# Altium schematic sheet UserInterface.SchDoc: Treetap 7C - User Interface
size A3; Author: Treetap Group; DrawnBy: Treetap Group; Revision: 1; SheetNumber: 7; SheetTotal: 7; PageSetup: Record=PageOptions|CenterHorizontal=True|CenterVertical=True|PrintScale=1.03|XCorrection=1.00|YCorrection=1.00|PrintKind=1|BorderSize=5000000|LeftOffset=0|BottomOffset=0|Orientation=2|PaperLength=1000|PaperWidth=1000|Scale=100|PaperSource=15|PrintQuality=600|MediaType=1|DitherType=10|PaperKind=A3|PrintScaleMode=1
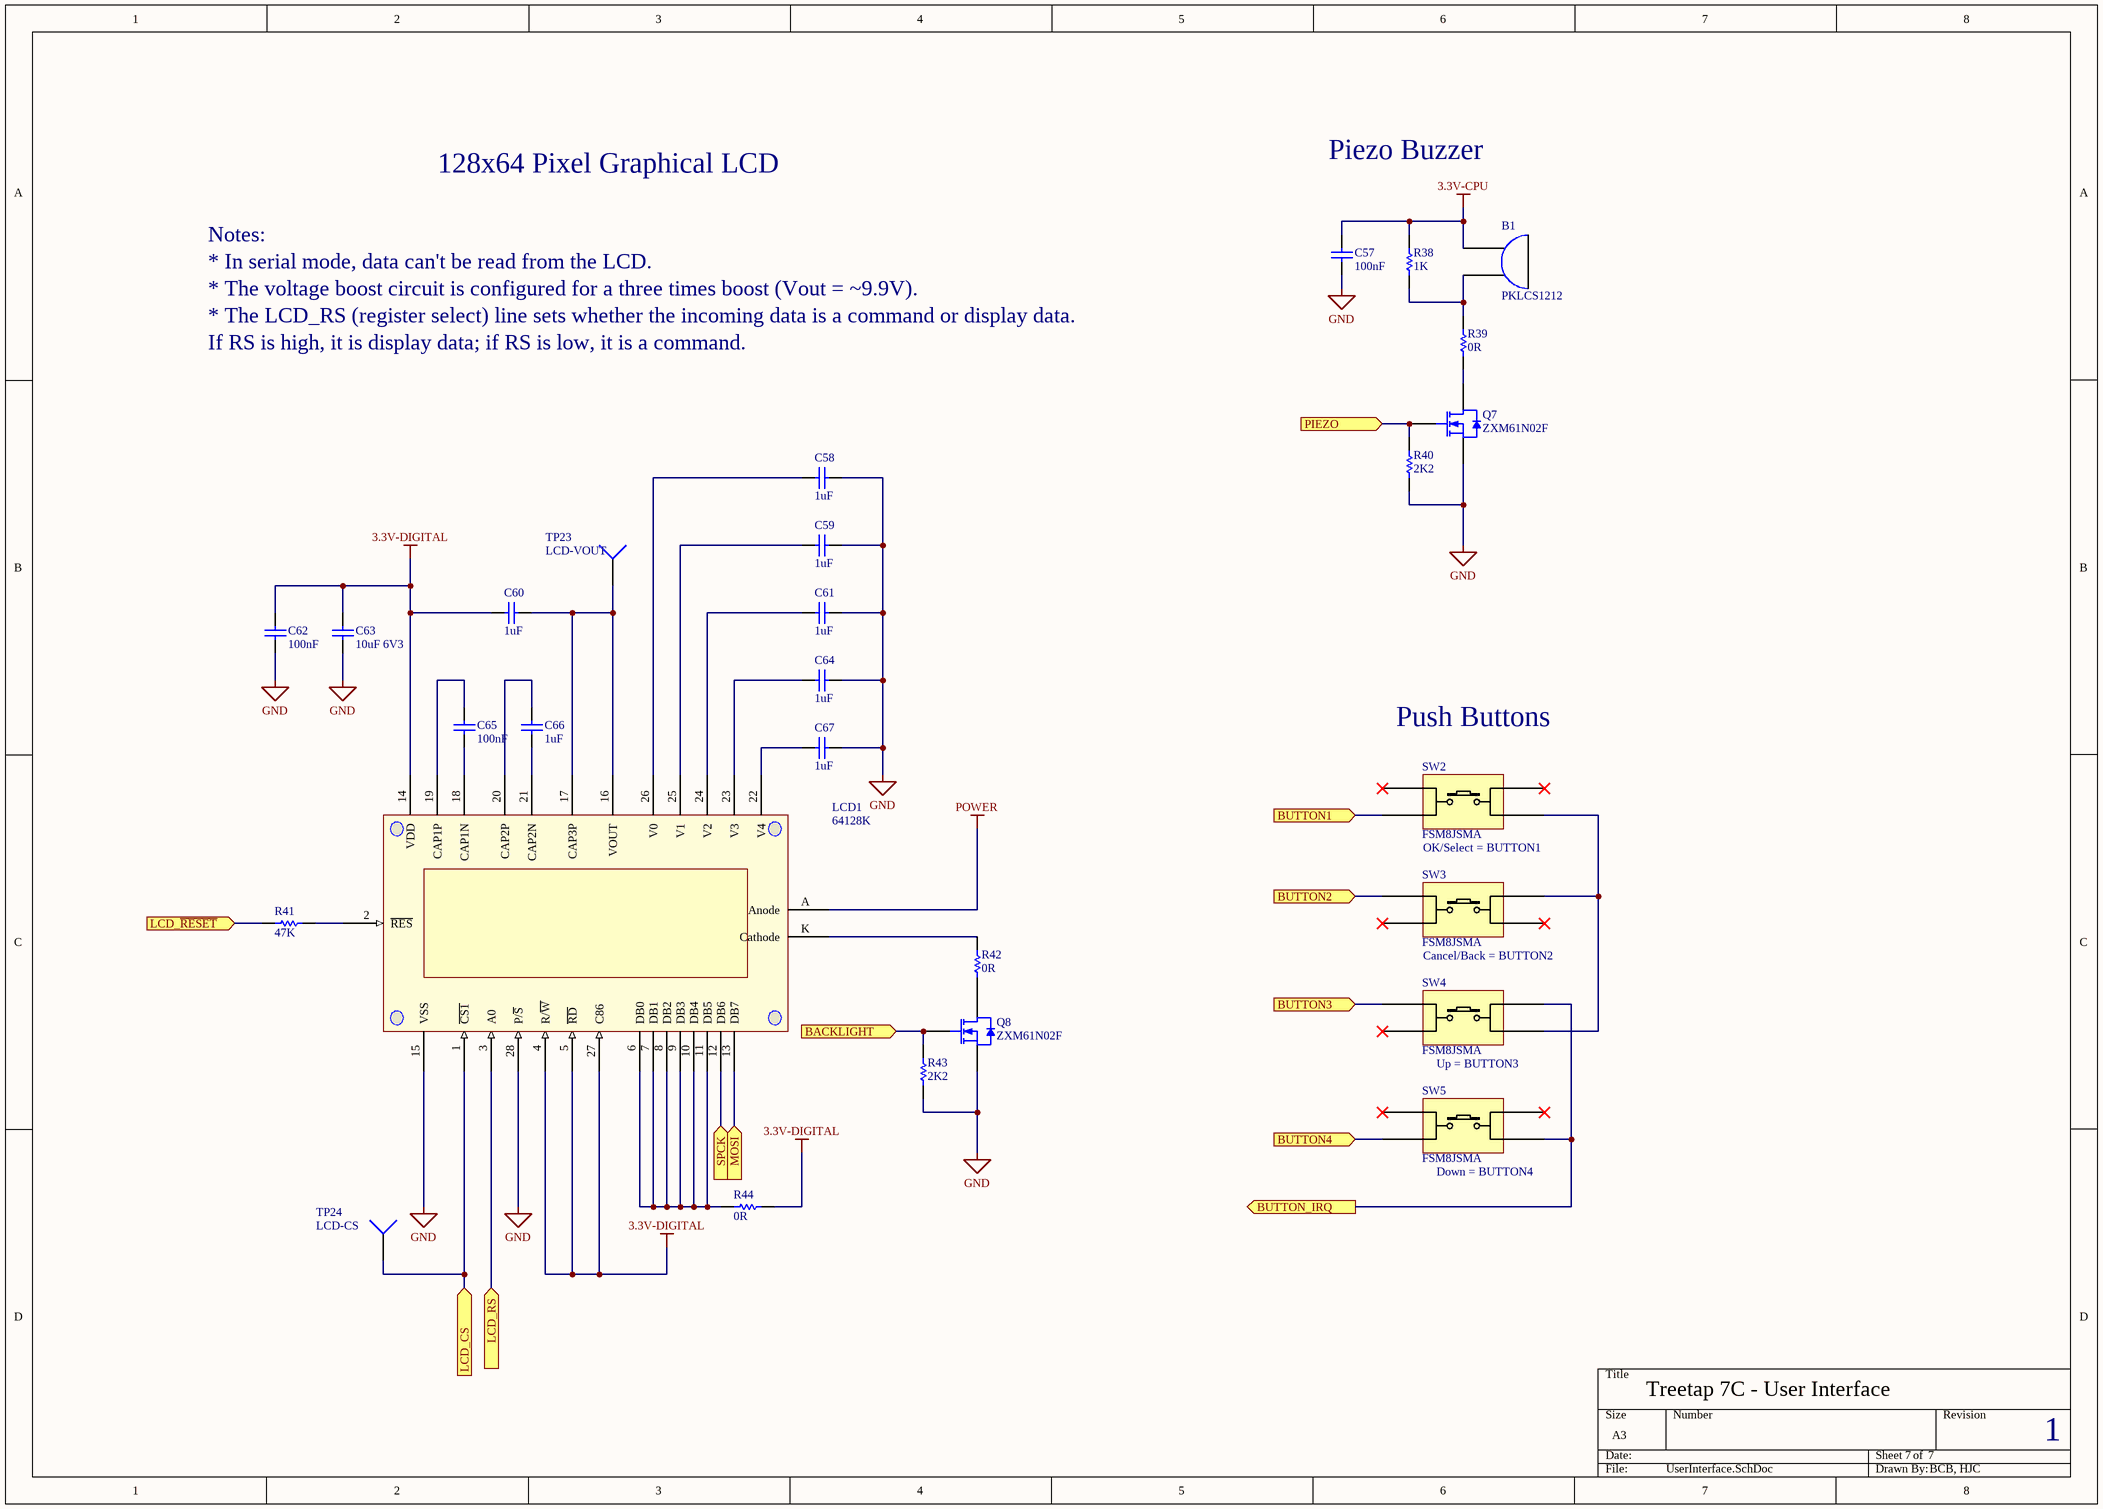
[diagram p0: UserInterface.SchDoc]

## Parts
B1  PKLCS1212  [PKSCL1212]
C57  100nF  [CC0603]
C58  1uF  [CC0603]
C59  1uF  [CC0603]
C60  1uF  [CC0603]
C61  1uF  [CC0603]
C62  100nF  [CC0603]
C63  10uF 6V3  [CC0603]
C64  1uF  [CC0603]
C65  100nF  [CC0603]
C66  1uF  [CC0603]
C67  1uF  [CC0603]
LCD1  64128K  [64128K]
Q7  ZXM61N02F  [SOT-23]
Q8  ZXM61N02F  [SOT-23]
R38  1K  [R0603]
R39  0R  [R0603]
R40  2K2  [R0603]
R41  47K  [R0603]
R42  0R  [R0603]
R43  2K2  [R0603]
R44  0R  [R0603]
SW2  FSM8JSMA  [FSM8JSMA]
SW3  FSM8JSMA  [FSM8JSMA]
SW4  FSM8JSMA  [FSM8JSMA]
SW5  FSM8JSMA  [FSM8JSMA]
TP23  LCD-VOUT  [SMTP_1]
TP24  LCD-CS  [SMTP_1]

## Ports
BACKLIGHT (in), BUTTON1 (in), BUTTON2 (in), BUTTON3 (in), BUTTON4 (in), BUTTON_IRQ (out), LCD_CS (in), LCD_RS (in), LCD_~{RESET} (in), MOSI (in), PIEZO (in), SPCK (in)

## Nets
3.3V-CPU: B1.0 C57.2 R38.2
3.3V-DIGITAL: C60.2 C62.2 C63.2 LCD1.4(R/~{W}) LCD1.5(~{RD}) LCD1.14(VDD) LCD1.27(C86) R44.2
GND: C57.1 C58.1 C59.1 C61.1 C62.1 C63.1 C64.1 C67.1 LCD1.15(VSS) LCD1.28(P/~{S}) Q7.2(S) Q8.2(S) R40.1 R43.1
POWER: LCD1.A(Anode)
BACKLIGHT: Q8.1(G) R43.2 ; port BACKLIGHT
BUTTON1: SW2.2 ; port BUTTON1
BUTTON2: SW3.1 ; port BUTTON2
BUTTON3: SW4.1 ; port BUTTON3
BUTTON4: SW5.2 ; port BUTTON4
BUTTON_IRQ: SW4.4 SW5.3 ; port BUTTON_IRQ
LCD_CS: LCD1.1(~{CS1}) TP24.1 ; port LCD_CS
LCD_~{RESET}: R41.1 ; port LCD_~{RESET}
LCD_RS: LCD1.3(A0) ; port LCD_RS
MOSI: LCD1.13(DB7) ; port MOSI
PIEZO: Q7.1(G) R40.2 ; port PIEZO
SPCK: LCD1.12(DB6) ; port SPCK
NetB1_1: B1.1 R38.1 R39.2
NetC58_2: C58.2 LCD1.26(V0)
NetC59_2: C59.2 LCD1.25(V1)
NetC60_1: C60.1 LCD1.16(VOUT) LCD1.17(CAP3P) TP23.1
NetC61_2: C61.2 LCD1.24(V2)
NetC64_2: C64.2 LCD1.23(V3)
NetC65_1: C65.1 LCD1.18(CAP1N)
NetC65_2: C65.2 LCD1.19(CAP1P)
NetC66_1: C66.1 LCD1.21(CAP2N)
NetC66_2: C66.2 LCD1.20(CAP2P)
NetC67_2: C67.2 LCD1.22(V4)
NetLCD1_2: LCD1.2(~{RES}) R41.2
NetLCD1_6: LCD1.6(DB0) LCD1.7(DB1) LCD1.8(DB2) LCD1.9(DB3) LCD1.10(DB4) LCD1.11(DB5) R44.1
NetLCD1_K: LCD1.K(Cathode) R42.2
NetQ7_3: Q7.3(D) R39.1
NetQ8_3: Q8.3(D) R42.1
NetSW2_3: SW2.3 SW3.4 SW4.3

Not connected (* = marked no-connect by the designer): SW2 1* 4*; SW3 2* 3*; SW4 2*; SW5 1* 4*

## Notes on the sheet
- 128x64 Pixel Graphical LCD
- Piezo Buzzer
- Notes:
- * In serial mode, data can't be read from the LCD.
- * The voltage boost circuit is configured for a three times boost (Vout = ~9.9V).
- * The LCD_RS (register select) line sets whether the incoming data is a command or display data.
- If RS is high, it is display data; if RS is low, it is a command.
- Push Buttons
- OK/Select = BUTTON1
- Cancel/Back = BUTTON2
- Up = BUTTON3
- (near SW5) Down = BUTTON4
- Treetap 7C - User Interface
- 7
- 1
- BCB, HJC

## Library data of the parts
B1 = PKLCS1212: 4kHz surface mount piezo; Manufacturer: Murata; Part Number: PKLCS1212E4001-R1; Order multiple: 1; price: 10.40; Supplier_Name: RS Components; Supplier_Component_Code: 619-8456; published: 15/02/2010; value: PKLCS1212; Pack of: 1
C57 C62 C65 = 100nF_CC0603: 0603 Capacitor; Supplier_Component_Code: RC-P100; published: 28/03/2007 10:54:57 a.m.; Supplier_Name: Soanar Plus; price: 0.09; value: 100nF; Part Number: 100nF_CC0603; Component Kind: Standard; Component Type: Standard; Designator: 100nF_CC0603; Pin Count: 2
C58-C61 C64 C66 C67 = 1uF_0603_25V_ceramic: 1uF 25V 0603 ceramic capacitor; Manufacturer: Kemet; Part Number: C0603C105K3PAC; Order multiple: 10; Pack of: 1; Supplier_Component_Code: 1288202; published: 15/02/2010; Supplier_Name: Farnell; price: 0.465; value: 1uF
C63 = 10uF_CC0603_6V3: 10uF 6.3V 0603 ceramic capacitor; Manufacturer: Multicomp; Part Number: MCCA000517; Supplier_Component_Code: 1759393; published: 8/06/2010; Supplier_Name: Farnell; price: 0.218; value: 10uF 6V3
LCD1 = 64128K: 64x128 COG LCD module; Part Number: 64128K-FC-BW-3; Manufacturer: Displaytech; Order multiple: 1; Supplier_Name: RS Components; Supplier_Component_Code: 564-399; price: 28.20; Published: 23/02/2010; Pack of: 1; value: 64128K
Q7 Q8 = ZXM61N02F: 20V N-channel enhancement mode MOSFET; Manufacturer: Zetex; Order multiple: 5; Pack of: 1; Supplier_Name: Farnell; Supplier_Component_Code: 9525270; price: 1.28; published: 7/12/2007; value: ZXM61N02F; Part Number: ZXM61N02F
R38 = 1K_R0603: 0603 Resistor; ECE_Component_Code: 1K_R0603; value: 1K; Supplier_Component_Code: RS-S073; published: 12/03/2007 11:34:34 a.m.; Supplier_Name: Soanar Plus; price: 0.08; Part Number: 1K_R0603; Component Kind: Standard; Component Type: Standard; Designator: 1K_R0603; Pin Count: 2
R39 R42 R44 = 0R_R0603: 0603 Resistor; ECE_Component_Code: 0R_R0603; Supplier_Component_Code: RS-S000; published: 12/03/2007 11:34:33 a.m.; Supplier_Name: Soanar Plus; price: 0.08; value: 0R; Part Number: 0R_R0603; Component Kind: Standard; Component Type: Standard; Designator: 0R_R0603; Pin Count: 2
R40 R43 = 2K2_R0603: 0603 Resistor; ECE_Component_Code: 2K2_R0603; value: 2K2; Supplier_Component_Code: RS-S081; published: 12/03/2007 11:34:34 a.m.; Supplier_Name: Soanar Plus; price: 0.08; Part Number: 2K2_R0603; Component Kind: Standard; Component Type: Standard; Designator: 2K2_R0603; Pin Count: 2
R41 = 47K_R0603: 0603 Resistor; ECE_Component_Code: 47K_R0603; value: 47K; Supplier_Component_Code: RS-S113; published: 12/03/2007 11:34:34 a.m.; Supplier_Name: Soanar Plus; price: 0.08; Part Number: 47K_R0603; Component Kind: Standard; Component Type: Standard; Designator: 47K_R0603; Pin Count: 2
SW2-SW5 = FSM8JSMA: DPST SMD Switch; Manufacturer: Tyco Electronics; Order multiple: 25; Pack of: 1; value: FSM8JSMA; Supplier_Name: Farnell; price: 0.61; Part Number: FSM8JSMA; Supplier_Component_Code: 1555992
TP23 TP24 = SMTestPoint: Test point hook (surface mount); Manufacturer: Harwin; Part Number: S1751-46; Order Multiple: 1; Pack of: 100; price: 40.01; published: 15/02/2010; Supplier_Name: Farnell; Supplier_Component_Code: 1022338; value: SMTestPoint